# EAGLE design 2_ATTINY_85_20SU (EAGLE 9.4.2)
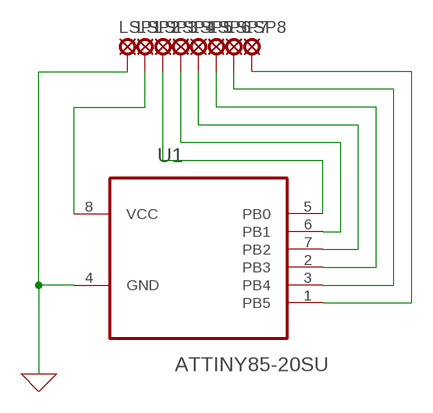
[diagram p0: schematic, sheet 1]

## Parts
LSP1  LSP10_CLSP10_C  [LSP10_C]
LSP2  LSP10_CLSP10_C  [LSP10_C]
LSP3  LSP10_CLSP10_C  [LSP10_C]
LSP4  LSP10_CLSP10_C  [LSP10_C]
LSP5  LSP10_CLSP10_C  [LSP10_C]
LSP6  LSP10_CLSP10_C  [LSP10_C]
LSP7  LSP10_CLSP10_C  [LSP10_C]
LSP8  LSP10_CLSP10_C  [LSP10_C]
U1  ATTINY85-20SU  [SOIC127P798X216-8N]

## Nets
0: LSP1.P$1(MP) U1.4(GND) ; supply symbol labelled GND
N$1: LSP2.P$1(MP) U1.8(VCC)
N$2: LSP3.P$1(MP) U1.5(PB0)
N$3: LSP4.P$1(MP) U1.6(PB1)
N$4: LSP5.P$1(MP) U1.7(PB2)
N$5: LSP6.P$1(MP) U1.2(PB3)
N$6: LSP7.P$1(MP) U1.3(PB4)
N$7: LSP8.P$1(MP) U1.1(PB5)

## Library data of the parts
LSP1-LSP8 = tbtaco-solpad:LSP10_C: SOLDER PAD drill 1.0 mm, distributor Buerklin, 12H555
U1 = ATTINY85-20SU:ATTINY85-20SU: 8-bit Microcontroller with In-System Programmable Flash; DESCRIPTION: Embedded microcontroller ATTINY85-20SU SOIC 8 Microchip Technology 8-Bit 20 MHz I/O number 6; DIGI-KEY_PART_NUMBER: ATTINY85-20SU-ND; DIGI-KEY_PURCHASE_URL: https://www.digikey.com/product-detail/en/microchip-technology/ATTINY85-20SU/ATTINY85-20SU-ND/735470?utm_source=snapeda&utm_medium=aggregator&utm_campaign=symbol; MF: Microchip; MP: ATTINY85-20SU; PACKAGE: SOIC-8 Microchip

## Board
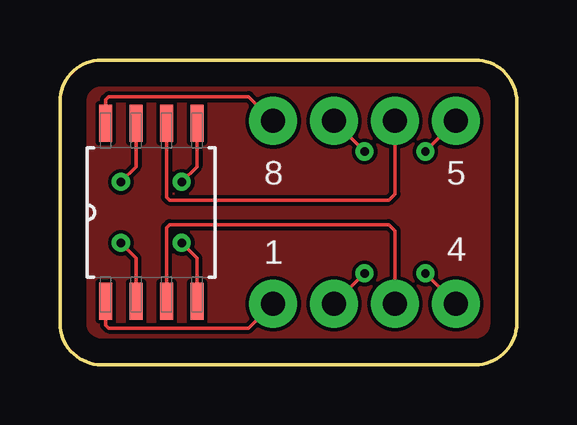
[diagram p1: board, top side]
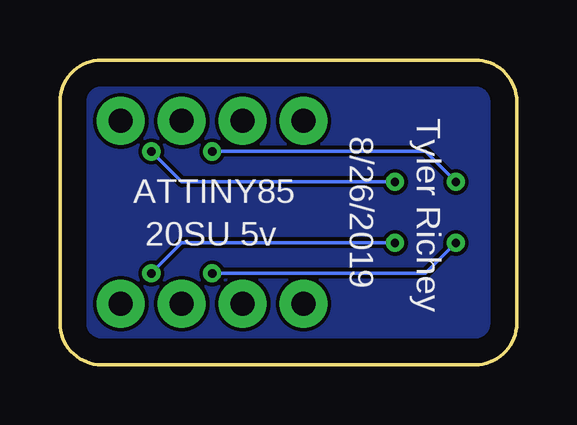
[diagram p2: board, bottom side, seen from below]

Size 19.05 x 12.7 mm. Coordinates in mm from the lower left corner, seen from the top.
Outline: 1.73,12.7 17.32,12.7 arc-90 19.05,10.97 19.05,1.73 arc-90 17.32,0 1.73,0 arc-90 0,1.73 0,10.97 arc-90 1.73,12.7
Copper layers (1*16): Top 0.035mm / dielectric 1.5mm / Bottom 0.035mm
Design rules "default": minimum track width 6mil, minimum drill 0.35mm, track to track 6mil, track to pad 6mil, pad to pad 6mil, via to via 6mil, smd to smd 6mil, copper to edge 40mil, drill to drill 6mil, minimum pad ring 10mil, minimum via ring 8mil, stop-mask expansion 4mil, vias tented up to drill 0mil, thermal gap 10mil

### Footprints (pad centres in the part's own frame; a part is rotated, then mirrored left to right if it is on the bottom)
LSP10_C = drill 1 pad 2: P$1 0,0
SOIC127P798X216-8N = smd 1.549 x 0.533: 1 -3.708,1.905; 2 -3.708,0.635; 3 -3.708,-0.635; 4 -3.708,-1.905; 5 3.708,-1.905; 6 3.708,-0.635; 7 3.708,0.635; 8 3.708,1.905

### Placement (x,y rotation side)
LSP1  16.51,2.54 0 top
LSP2  8.89,10.16 0 top
LSP3  16.51,10.16 0 top
LSP4  13.97,10.16 0 top
LSP5  11.43,10.16 0 top
LSP6  11.43,2.54 0 top
LSP7  13.97,2.54 0 top
LSP8  8.89,2.54 0 top
U1  3.81,6.35 90 top

### Tracks (layer width: path | path; a pad name or v marks a point on that pad's centre or on a via)
0  (via drill 0.35)
  Top 0.152: U1.4 5.72,4.45 v5.08,5.08 | v15.24,3.81 LSP1.P$1
  Bottom 0.152: v15.24,3.81 13.97,5.08 v5.08,5.08
GND
  pour Top: -0.25,12.95 -0.25,-0.25 19.3,-0.25 19.3,12.95
  pour Bottom: 11.68,12.7 17.02,12.7 17.53,12.7 19.05,11.18 19.05,1.52 17.53,0 1.52,0 0,1.52 0,10.92 1.78,12.7
N$1
  Top 0.152: U1.8 1.91,11.05 2.03,11.18 7.87,11.18 LSP2.P$1
N$2  (via drill 0.35)
  Top 0.152: U1.5 5.72,8.25 v5.08,7.62 | v15.24,8.89 LSP3.P$1
  Bottom 0.152: v15.24,8.89 13.97,7.62 v5.08,7.62
N$3
  Top 0.152: U1.6 4.45,6.98 4.57,6.86 13.72,6.86 13.97,7.11 LSP4.P$1
N$4  (via drill 0.35)
  Top 0.152: U1.7 3.18,8.25 v2.54,7.62 | LSP5.P$1 v12.7,8.89
  Bottom 0.152: v2.54,7.62 3.81,8.89 v12.7,8.89
N$5  (via drill 0.35)
  Top 0.152: U1.2 3.18,4.45 v2.54,5.08 | LSP6.P$1 v12.7,3.81
  Bottom 0.152: v2.54,5.08 3.81,3.81 v12.7,3.81
N$6
  Top 0.152: U1.3 4.45,5.71 4.57,5.84 13.72,5.84 13.97,5.59 LSP7.P$1
N$7
  Top 0.152: U1.1 1.91,1.65 2.03,1.52 7.87,1.52 LSP8.P$1

### Text on the board
tPlace: 8 | 5 | 1 | 4
bPlace: Tyler Richey | 8/26/2019 | ATTINY85 | 20SU 5v